# Altium project FlyBox2.PrjPcb
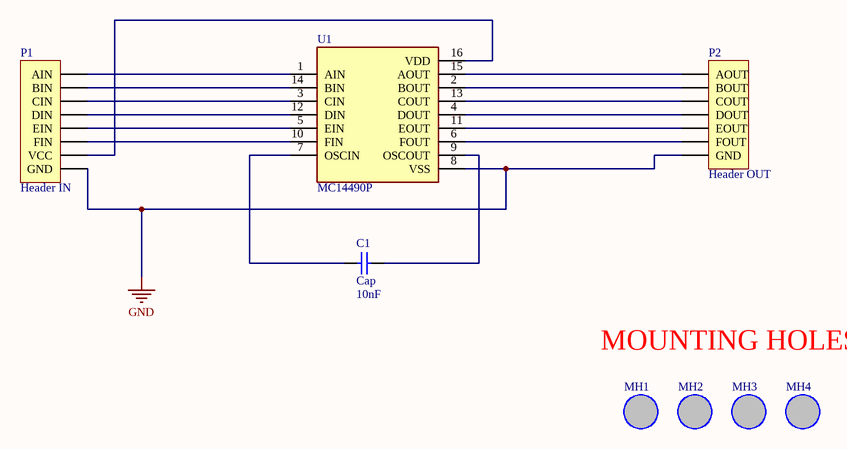
[diagram p0: MC14490P_module_PCB.SchDoc]
PgTitle: module
2 sheets, 18 parts. Net scope: flat (ports and power ports of the same name join across sheets).
Board files: MC14490P_module_PCB.PcbDoc, Flybox2_main_board.PcbDoc
Sheets:
  MC14490P_module_PCB.SchDoc
  Flybox2_main_board.SchDoc

## Sheet MC14490P_module_PCB.SchDoc: pipp
size A

### Parts
(Parts that share a designator on the sheet are numbered #1, #2 ... from top to bottom, then left to right.)
C1  Cap  value 10nF  [RAD-0.1]
MH1  Mounting Hole 3.2mm Drill  [MH_3.2MMD]  (value not drawn)  (no BOM)
MH2  Mounting Hole 3.2mm Drill  [MH_3.2MMD]  (value not drawn)  (no BOM)
MH3  Mounting Hole 3.2mm Drill  [MH_3.2MMD]  (value not drawn)  (no BOM)
MH4  Mounting Hole 3.2mm Drill  [MH_3.2MMD]  (value not drawn)  (no BOM)
P1#1  Header IN  [HDR1X8]
P2#1  Header OUT  [HDR1X7]
U1#1  MC14490P  [DIP762W46P254L1918H444Q16P]

### Nets
GND: P1#1.1(GND) P2#1.1(GND) U1#1.8(VSS)
NetC1_1: C1.1 U1#1.7(OSCIN)
NetC1_2: C1.2 U1#1.9(OSCOUT)
NetP1#1_2: P1#1.2(VCC) U1#1.16(VDD)
NetP1#1_3: P1#1.3(FIN) U1#1.10(FIN)
NetP1#1_4: P1#1.4(EIN) U1#1.5(EIN)
NetP1#1_5: P1#1.5(DIN) U1#1.12(DIN)
NetP1#1_6: P1#1.6(CIN) U1#1.3(CIN)
NetP1#1_7: P1#1.7(BIN) U1#1.14(BIN)
NetP1#1_8: P1#1.8(AIN) U1#1.1(AIN)
NetP2#1_2: P2#1.2(FOUT) U1#1.6(FOUT)
NetP2#1_3: P2#1.3(EOUT) U1#1.11(EOUT)
NetP2#1_4: P2#1.4(DOUT) U1#1.4(DOUT)
NetP2#1_5: P2#1.5(COUT) U1#1.13(COUT)
NetP2#1_6: P2#1.6(BOUT) U1#1.2(BOUT)
NetP2#1_7: P2#1.7(AOUT) U1#1.15(AOUT)

### Notes on the sheet
- MOUNTING HOLES

### Library data of the parts
C1 = Cap: Capacitor; Published: 8-Jun-2000; LatestRevisionDate: 17-Jul-2002; LatestRevisionNote: Re-released for DXP Platform.; PackageReference: RAD-0.3; Publisher: Altium Limited; PackageDescription: Radial Cap, Thru-Hole; 2 Leads; 0.3 in Pin Spacing
MH1-MH4 = MH_3.2MMD
P1#1 = Header 8: Header, 8-Pin; LatestRevisionDate: 17-Jul-2002; LatestRevisionNote: Re-released for DXP Platform.; Publisher: Altium Limited
P2#1 = Header 7: Header, 7-Pin; LatestRevisionDate: 17-Jul-2002; LatestRevisionNote: Re-released for DXP Platform.; Publisher: Altium Limited
U1#1 = MC14490P: Contact Bounce Eliminator IC 16-DIP; MF: ON Semiconductor; Value: *; Availability: Unavailable; Package: DIP-16 ON Semiconductor; Price: None; SnapEDA_Link: https://www.snapeda.com/parts/MC14490P/ON%20Semiconductor/view-part/4220489/?ref=snap; MP: MC14490P

## Sheet Flybox2_main_board.SchDoc
size A
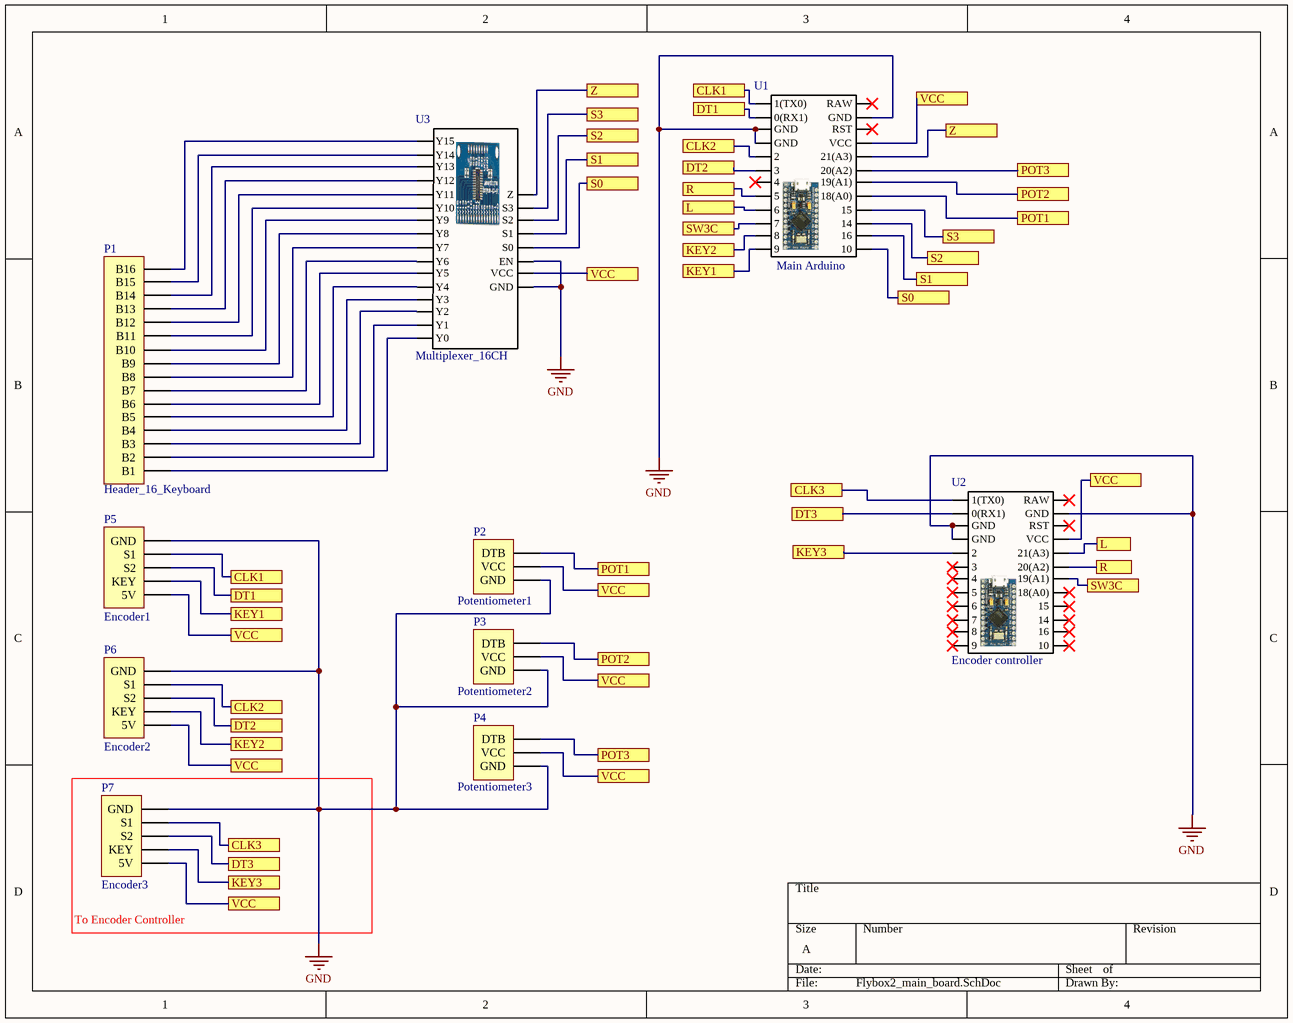
[diagram p1: Flybox2_main_board.SchDoc]

### Parts
(Parts that share a designator on the sheet are numbered #1, #2 ... from top to bottom, then left to right.)
P1#2  Header_16_Keyboard  [HDR1X16_Buttons]
P2#2  Potentiometer1
P3  Potentiometer2
P4  Potentiometer3
P5  Encoder1  [HDR1X5_Encoder]
P6  Encoder2  [HDR1X5_Encoder]
P7  Encoder3  [HDR1X5_Encoder]
U1#2  Main Arduino  [Arduino_Pro_Micro_Board]
U2  Encoder controller  [Arduino_Pro_Micro_Board]
U3  Multiplexer_16CH  [Multiplexer_16CH]

### Blocks framed on the sheet
To Encoder Controller: P7

### Ports
CLK1, CLK2, CLK3, DT1, DT2, DT3, KEY1, KEY2, KEY3, L, POT1, POT2, POT3, R, S0, S1, S2, S3, SW3C, VCC, Z

### Nets
GND: P2#2.1(GND) P3.1(GND) P4.1(GND) P5.1(GND) P6.1(GND) P7.1(GND) U1#2.3(GND) U1#2.4(GND) U1#2.14(GND) U2.3(GND) U2.4(GND) U2.14(GND) U3.17(GND) U3.19(EN)
NetP1#2_1: P1#2.1(B1) U3.1(Y0)
NetP1#2_2: P1#2.2(B2) U3.2(Y1)
NetP1#2_3: P1#2.3(B3) U3.3(Y2)
NetP1#2_4: P1#2.4(B4) U3.4(Y3)
NetP1#2_5: P1#2.5(B5) U3.5(Y4)
NetP1#2_6: P1#2.6(B6) U3.6(Y5)
NetP1#2_7: P1#2.7(B7) U3.7(Y6)
NetP1#2_8: P1#2.8(B8) U3.8(Y7)
NetP1#2_9: P1#2.9(B9) U3.9(Y8)
NetP1#2_10: P1#2.10(B10) U3.10(Y9)
NetP1#2_11: P1#2.11(B11) U3.11(Y10)
NetP1#2_12: P1#2.12(B12) U3.12(Y11)
NetP1#2_13: P1#2.13(B13) U3.13(Y12)
NetP1#2_14: P1#2.14(B14) U3.14(Y13)
NetP1#2_15: P1#2.15(B15) U3.15(Y14)
NetP1#2_16: P1#2.16(B16) U3.16(Y15)
NetP2#2_2: P2#2.2(VCC) P3.2(VCC) P4.2(VCC) P5.5(5V) P6.5(5V) P7.5(5V) U1#2.16(VCC) U2.16(VCC) U3.18(VCC) ; port VCC
NetP2#2_3: P2#2.3(DTB) U1#2.20(18(A0)) ; port POT1
NetP3_3: P3.3(DTB) U1#2.19(19(A1)) ; port POT2
NetP4_3: P4.3(DTB) U1#2.18(20(A2)) ; port POT3
NetP5_2: P5.2(S1) U1#2.1(1(TX0)) ; port CLK1
NetP5_3: P5.3(S2) U1#2.2(0(RX1)) ; port DT1
NetP5_4: P5.4(KEY) U1#2.12(9) ; port KEY1
NetP6_2: P6.2(S1) U1#2.5(2) ; port CLK2
NetP6_3: P6.3(S2) U1#2.6(3) ; port DT2
NetP6_4: P6.4(KEY) U1#2.11(8) ; port KEY2
NetP7_2: P7.2(S1) U2.1(1(TX0)) ; port CLK3
NetP7_3: P7.3(S2) U2.2(0(RX1)) ; port DT3
NetP7_4: P7.4(KEY) U2.5(2) ; port KEY3
NetU1#2_8: U1#2.8(5) U2.18(20(A2)) ; port R
NetU1#2_9: U1#2.9(6) U2.17(21(A3)) ; port L
NetU1#2_10: U1#2.10(7) U2.19(19(A1)) ; port SW3C
NetU1#2_17: U1#2.17(21(A3)) U3.24(Z) ; port Z
NetU1#2_21: U1#2.21(15) U3.23(S3) ; port S3
NetU1#2_22: U1#2.22(14) U3.22(S2) ; port S2
NetU1#2_23: U1#2.23(16) U3.21(S1) ; port S1
NetU1#2_24: U1#2.24(10) U3.20(S0) ; port S0

Not connected (* = marked no-connect by the designer): U1#2 7(4)* 13(RAW)* 15(RST)*; U2 6(3)* 7(4)* 8(5)* 9(6)* 10(7)* 11(8)* 12(9)* 13(RAW)* 15(RST)* 20(18(A0))* 21(15)* 22(14)* 23(16)* 24(10)*

### Library data of the parts
P2#2 P3 P4 = Header3_Potentiometer
P5-P7 = Header_5_Encoder: Header 5 pins to connect one encoder
U1#2 U2 = Arduino_Pro_Micro: Arduino pro micro board

## Nets that join several sheets
GND: MC14490P_module_PCB (P1#1.1 P2#1.1 U1#1.8), Flybox2_main_board (14 pins)